# Altium schematic sheet MCU.SchDoc: =ProjectName
size A4; CheckedBy: DatNB; Author: Ven; CompanyName: Nacentech; Organization: IMET
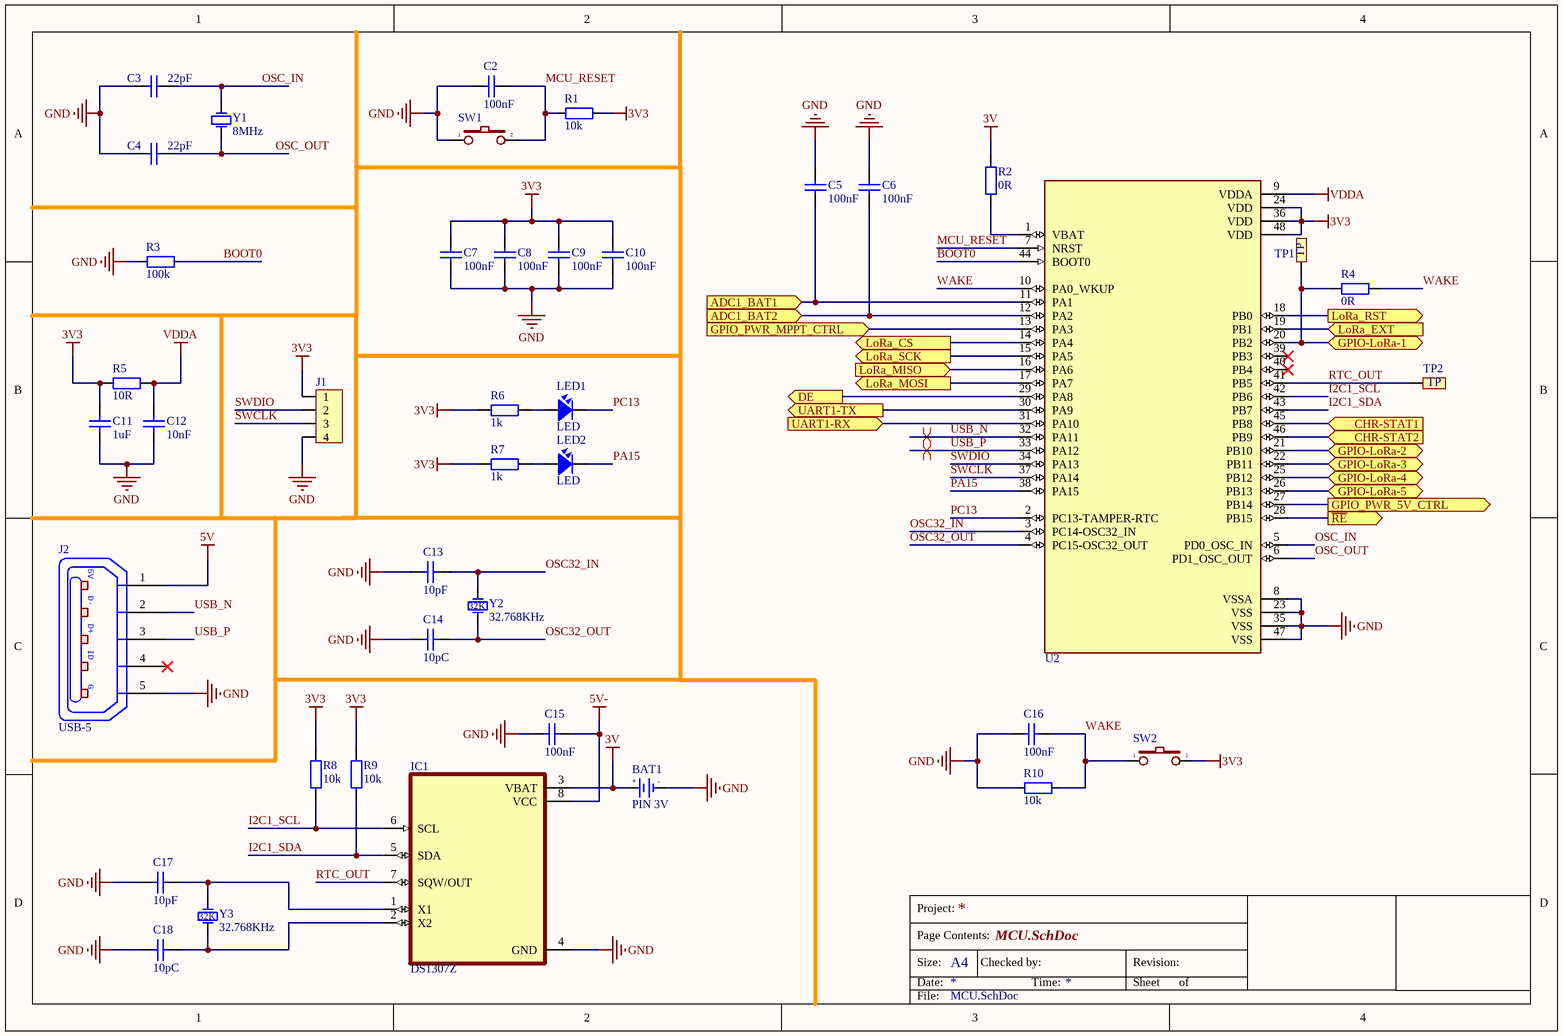
[diagram p0: MCU.SchDoc]

## Parts
BAT1  PIN 3V  [CR1220 SMD]
C2  100nF  [CAP_0805]
C3  22pF  [CAP_0805]
C4  22pF  [CAP_0805]
C5  100nF  [CAP_0805]
C6  100nF  [CAP_0805]
C7  100nF  [CAP_0805]
C8  100nF  [CAP_0805]
C9  100nF  [CAP_0805]
C10  100nF  [CAP_0805]
C11  1uF  [CAP_0805]
C12  10nF  [CAP_0805]
C13  10pF  [CAP_0805]
C14  10pC  [CAP_0805]
C15  100nF  [CAP_0805]
C16  100nF  [CAP_0805]
C17  10pF  [CAP_0805]
C18  10pC  [CAP_0805]
IC1  DS1307Z  [SOIC-8]
J1  ST_Link  [HEADER4P-1.25]  (value not drawn)
J2  USB-5  [USB-M1]
LED1  LED  [LED-0805-Red]
LED2  LED  [LED-0805-Yellow]
R1  10k  [RES-SMD-0805]
R2  0R  [RES-SMD-0805]
R3  100k  [RES-SMD-0805]
R4  0R  [RES-SMD-0805]
R5  10R  [RES-SMD-0805]
R6  1k  [RES-SMD-0805]
R7  1k  [RES-SMD-0805]
R8  10k  [RES-SMD-0805]
R9  10k  [RES-SMD-0805]
R10  10k  [RES-SMD-0805]
SW1  SW  [SW 3x2x4]  (value not drawn)
SW2  SW  [SW 3x2x4]  (value not drawn)
TP1  Test Point  [TP_SMD]  (value not drawn)
TP2  Test Point  [TP_SMD]  (value not drawn)
U2  STM32  [LQFP 48]  (value not drawn)
Y1  8MHz  [XTAL]
Y2  32.768KHz  [XTAL32K]
Y3  32.768KHz  [XTAL32K]

## Ports
ADC1_BAT1 (in), ADC1_BAT2 (in), CHR-STAT1 (in), CHR-STAT2 (in), DE (out), GPIO-LoRa-1 (bidir), GPIO-LoRa-2 (bidir), GPIO-LoRa-3 (bidir), GPIO-LoRa-4 (bidir), GPIO-LoRa-5 (bidir), GPIO_PWR_5V_CTRL (out), GPIO_PWR_MPPT_CTRL (in), LoRa_CS (out), LoRa_EXT (in), LoRa_MISO (in), LoRa_MOSI (out), LoRa_RST (out), LoRa_SCK (out), UART1-RX (in), UART1-TX (out), ~{RE} (out)

## Nets
3V: BAT1.1(+3V) IC1.3(VBAT) R2.2
3V3: C7.2 C8.2 C9.2 C10.2 C11.2 J1.1 R1.1 R5.1 R6.1 R7.1 R8.2 R9.2 SW2.2 U2.24(VDD) U2.36(VDD) U2.48(VDD)
5V: J2.1(P1)
5V-: C15.2 IC1.8(VCC)
GND: BAT1.2(GND) C2.1 C3.1 C4.1 C5.2 C6.2 C7.1 C8.1 C9.1 C10.1 C11.1 C12.1 C13.2 C14.2 C15.1 C16.1 C17.2 C18.2 IC1.4(GND) J1.4 J2.5(P5) R3.2 R10.2 SW1.1 U2.8(VSSA) U2.23(VSS) U2.35(VSS) U2.47(VSS)
VDDA: C12.2 R5.2 U2.9(VDDA)
ADC1_BAT1: C5.1 U2.11(PA1) ; port ADC1_BAT1
ADC1_BAT2: C6.1 U2.12(PA2) ; port ADC1_BAT2
BOOT0: R3.1 U2.44(BOOT0)
CHR-STAT1: U2.45(PB8) ; port CHR-STAT1
CHR-STAT2: U2.46(PB9) ; port CHR-STAT2
DE: U2.29(PA8) ; port DE
GPIO-LoRa-1: R4.2 TP1.1 U2.20(PB2) ; port GPIO-LoRa-1
GPIO-LoRa-2: U2.21(PB10) ; port GPIO-LoRa-2
GPIO-LoRa-3: U2.22(PB11) ; port GPIO-LoRa-3
GPIO-LoRa-4: U2.25(PB12) ; port GPIO-LoRa-4
GPIO-LoRa-5: U2.26(PB13) ; port GPIO-LoRa-5
GPIO_PWR_5V_CTRL: U2.27(PB14) ; port GPIO_PWR_5V_CTRL
GPIO_PWR_MPPT_CTRL: U2.13(PA3) ; port GPIO_PWR_MPPT_CTRL
I2C1_SCL: IC1.6(SCL) R8.1 U2.42(PB6)
I2C1_SDA: IC1.5(SDA) R9.1 U2.43(PB7)
LoRa_CS: U2.14(PA4) ; port LoRa_CS
LoRa_EXT: U2.19(PB1) ; port LoRa_EXT
LoRa_MISO: U2.16(PA6) ; port LoRa_MISO
LoRa_MOSI: U2.17(PA7) ; port LoRa_MOSI
LoRa_RST: U2.18(PB0) ; port LoRa_RST
LoRa_SCK: U2.15(PA5) ; port LoRa_SCK
MCU_RESET: C2.2 R1.2 SW1.2 U2.7(NRST)
OSC32_IN: C13.1 U2.3(PC14-OSC32_IN) Y2.1(OSC1)
OSC32_OUT: C14.1 U2.4(PC15-OSC32_OUT) Y2.2(OSC2)
OSC_IN: C3.2 U2.5(PD0_OSC_IN) Y1.1(OSC1)
OSC_OUT: C4.2 U2.6(PD1_OSC_OUT) Y1.2(OSC2)
PA15: LED2.2 U2.38(PA15)
PC13: LED1.2 U2.2(PC13-TAMPER-RTC)
~{RE}: U2.28(PB15) ; port ~{RE}
RTC_OUT: IC1.7(SQW/OUT) TP2.1 U2.41(PB5)
SWCLK: J1.3 U2.37(PA14)
SWDIO: J1.2 U2.34(PA13)
UART1-RX: U2.31(PA10) ; port UART1-RX
UART1-TX: U2.30(PA9) ; port UART1-TX
USB_N: J2.2(P2) U2.32(PA11)
USB_P: J2.3(P3) U2.33(PA12)
WAKE: C16.2 R4.1 R10.1 SW2.1 U2.10(PA0_WKUP)
NetC17_1: C17.1 IC1.1(X1) Y3.1(OSC1)
NetC18_1: C18.1 IC1.2(X2) Y3.2(OSC2)
NetLED1_1: LED1.1 R6.2
NetLED2_1: LED2.1 R7.2
NetR2_1: R2.1 U2.1(VBAT)

Not connected (* = marked no-connect by the designer): J2 4(P4)*; U2 39(PB3)* 40(PB4)*

## Layout directives
differential pair: USB_N, USB_P

## Notes on the sheet
- Project:
- Page Contents:
- Size:
- Date:
- A4
- Checked by:
- Time:
- Revision:
- Sheet
- of
- File:
- (in symbol PIN 3V) +; -
- (in symbol USB-5) 5V; D-; D+; ID; G
- (in symbol XTAL/32KHz) 32K

## Library data of the parts
BAT1 = PIN 3V: Battery 3VDC; Value: PIN 3V
C2-C18 = CapSMD: Capacitor; Value: 33p; Published: 8-Jun-2000; LatestRevisionDate: 17-Jul-2002; LatestRevisionNote: Re-released for DXP Platform.; PackageReference: RAD-0.3; Publisher: Altium Limited
J1 = Header4: Header IDC, 4 x 1 Pin Vertical 2.54mm Pitch (Non-Boxed, Male); Manufacturer: W¨¹rth Elektronik eiSos GmbH; partNo: 613002143121; ComponentLink1 Description: Manufacturer; ComponentLink2 Description: Datasheet; NoPins: 02; Created Date: 29 March 2013; ComponentLink1URL: http://www.we-online.com; ComponentLink2URL: http://katalog.we-online.de/em/datasheet/6130xx143121.pdf; Created by: Karrer Zheng
J2 = USB-5: Manufacturer: FCI; Manufacturer Part Number: 10118193-0001LF; Connector Type: USB - micro B; Number of Contacts: 5; Gender: Receptacle; Specifications: USB 2.0; .Creator: MM; .Checked PCB: RF; Supplier 1: Digi-Key; RoHS: RoHS Compliant; Category: Connectors, Interconnects; Stock 1: 28642; Pricing 1: 1=0.46, 10=0.433, 25=0.3712, 50=0.3156, 100=0.3032, 250=0.27224, 500=0.25988 (USD); Packaging: Cut Tape (CT); Mounting Type: Surface Mount, Right Angle, Horizontal; Features: Shielded, Solder Retention; Ingress Protection: -; ComponentLink1URL: http://portal.fciconnect.com/Comergent//fci/drawing/10118193.pdf; ComponentLink1Description: http://portal.fciconnect.com/Comergent//fci/drawing/10118193.pdf; Supplier Part Number 1: 609-4616-1-ND; .Checked SCH: MM
LED1 LED2 = LED: LED Single colour Green and Red; Value: LED 3 ly Single Colour
R1 R3 R10 = Resistor - SMD: Resistor; Manufacturer: Generic Components; Class: Passive; Published: 08/06/2000; Publisher: Altium Hobart Technology Centre
R2 R4-R9 = Resistor - SMD: Resistor SMD; Manufacturer: Generic Components; Class: Passive; Published: 08/06/2000; Publisher: Altium Hobart Technology Centre
SW1 SW2 = SW2: Switch button 2 pin; Value: SW chip 2 pin
TP1 TP2 = TP: CONNECT 1
U2 = STM32F103C8T6: STM32 ARM-based 32-bit MCU with 64 Kbytes Flash, 64-pin LQFP, Industrial Temperature
Y1 = XTAL: Crystal Oscillator; Published: 8-Jun-2000; LatestRevisionDate: 17-Jul-2002; LatestRevisionNote: Re-released for DXP Platform.; PackageReference: R38; Publisher: Altium Limited
Y2 Y3 = XTAL/32KHz: Crystal Oscillator; Published: 8-Jun-2000; LatestRevisionDate: 17-Jul-2002; LatestRevisionNote: Re-released for DXP Platform.; PackageReference: R38; Publisher: Altium Limited